# Altium schematic sheet Temp_Sensor.SchDoc: Temp_Sensor
size Letter; Author: Nicholas J. Sorensen, and Erik F. Halliwell; Engineer: Nicholas J. Sorensen, and Erik F. Halliwell; DocumentNumber: 5; SheetNumber: 5; SheetTotal: 7
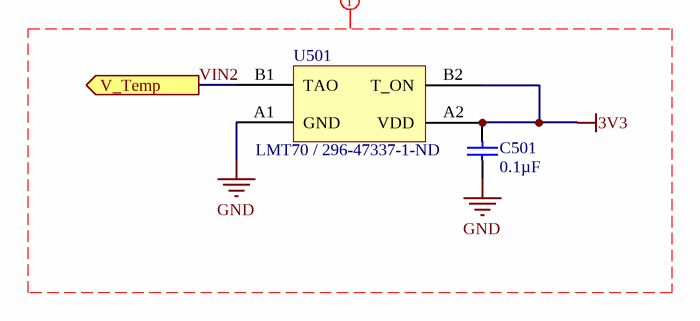
[diagram p0: Temp_Sensor.SchDoc]

## Parts
C501  value 0.1µF  [TDK-CGA2B]  (hidden comment: Cap)
U501  LMT70 / 296-47337-1-ND  [TI-YFQ0004]

## Ports
V_Temp (out)

## Nets
3V3: C501.2 U501.A2(VDD) U501.B2(T_ON)
GND: C501.1 U501.A1(GND)
VIN2: U501.B1(TAO) ; port V_Temp

## Layout directives
mark named Temperature Sensors: 3V3, GND, VIN2

## Notes on the sheet
- (the "License"); you may not use or redistribute this file except in compliance with the License. You
- This file and the information within it are licensed under the terms of the Apache License, Version 2.0
- Copyright
- Unless required by applicable law or agreed to in writing, content distributed under the License is
- distributed on an "AS IS" BASIS, WITHOUT WARRANTIES OR CONDITIONS OF ANY KIND,
- either express or implied. See the License for the specific language governing permissions and
- limitations under the License.
- may obtain a copy of the License at:
- http://www.apache.org/licenses/LICENSE-2.0
- Title
- Size:
- Date:
- Letter
- Number:
- Time:
- Revision:
- Sheet
- of
- University of Alberta
- Deptartment of Electrical
- and Computer Engineering
- Edmonton AB, Canada
- T6G 1H9
- File:

## Library data of the parts
C501 = PC-TDK-02259: CAP CER 0.1UF 50V X7R 0402; Manufacturer Part Number: CGA2B3X7R1H104K050BB; Index: 2259; Tolerance: ±10%; Published: 2016-03-16; LatestRevisionDate: 2016-03-16; LatestRevisionNote: ...; PackageReference: 0402 (1005 Metric); Publisher: AlbertaSat; PackageDescription: Radial Cap, Thru-Hole; 2 Leads; 0.3 in Pin Spacing; Part Number: PC-TDK-02259; Supplier Part Number 1: 445-6899-1-ND; Supplier 1: Digi-key; Supplier Link: http://www.digikey.ca/product-search/en?keywords=445-6899-1-ND; Voltage - Rated: 50V; Temperature Coefficient: X7R; Applications: Automotive
U501 = 70: Temperature Sensor Analog, Local -55°C ~ 150°C 5.194mV/°C 4-DSBGA (0.81x0.81); Part Number: 70; Manufacturer Part Number: LMT70YFQR; Supplier Part Number 1: 296-47337-1-ND; Supplier 1: Digi-Key; Supplier Link: #https://www.digikey.ca/product-detail/en/texas-instruments/LMT70YFQR/296-47337-1-ND/7688347#; PackageReference: BGA, 4-Leads, Body 0.88x0.88mmx0.68mm, Pitch 0.40mm; Operating Temperature: -55°C ~ 150°C